# Altium schematic sheet Microcontroller.SchDoc: Payload Card Microcontroller
size A2; Revision: 1A; SheetNumber: 4; SheetTotal: 6; Organization: Brickworks; Address1: Matthew Glazer; Address2: Design Engineer
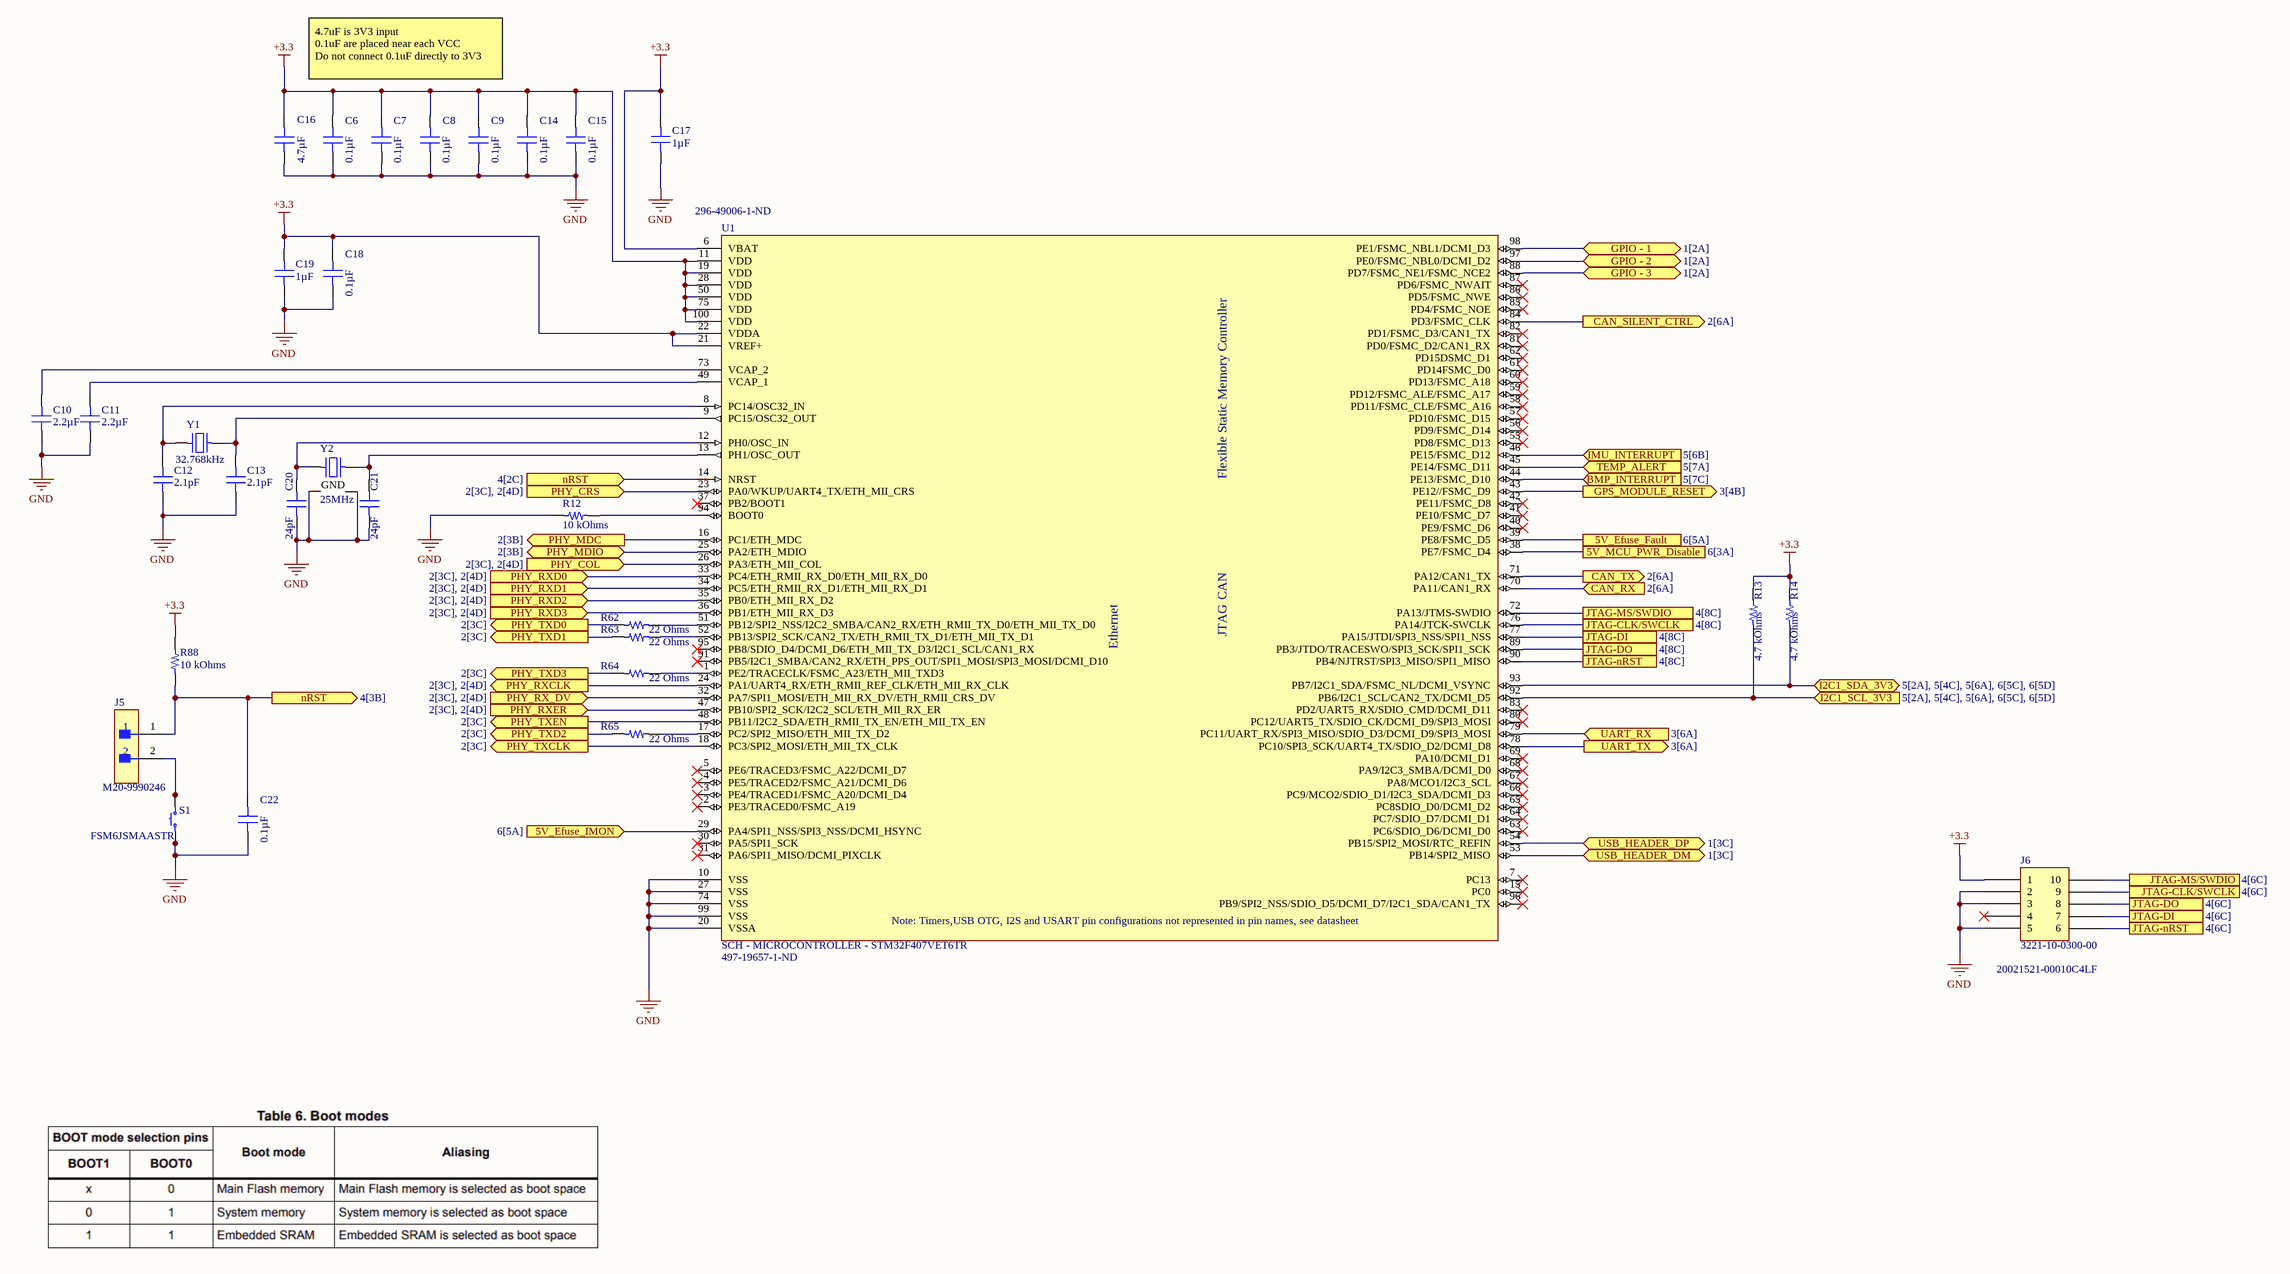
[diagram p0: Microcontroller.SchDoc]

## Parts
C6  0.1µF  [CAP 0603_1608]
C7  0.1µF  [CAP 0603_1608]
C8  0.1µF  [CAP 0603_1608]
C9  0.1µF  [CAP 0603_1608]
C10  2.2µF  [CAP 0603_1608]
C11  2.2µF  [CAP 0603_1608]
C12  2.1pF  [CAP 0603_1608]
C13  2.1pF  [CAP 0603_1608]
C14  0.1µF  [CAP 0603_1608]
C15  0.1µF  [CAP 0603_1608]
C16  4.7µF  [CAP 0603_1608]
C17  1µF  [CAP 0603_1608]
C18  0.1µF  [CAP 0603_1608]
C19  1µF  [CAP 0603_1608]
C20  24pF  [CAP 0603_1608]
C21  24pF  [CAP 0603_1608]
C22  0.1µF  [CAP 0603_1608]
J5  M20-9990246  [FP-M20-9990246-MFG]
J6  3221-10-0300-00  [CNC TECH 3221-10-0300-00]
R12  10 kOhms  [RES 0603_1608]
R13  4.7 kOhms  [RES 0603_1608]
R14  4.7 kOhms  [RES 0603_1608]
R62  22 Ohms  [RES 0603_1608]
R63  22 Ohms  [RES 0603_1608]
R64  22 Ohms  [RES 0603_1608]
R65  22 Ohms  [RES 0603_1608]
R88  10 kOhms  [RES 0603_1608]
S1  FSM6JSMAASTR  [TE FSM6JSMA]
U1  SCH - MICROCONTROLLER - STM32F407VET6TR  Supplier Part Number 1: 497-19657-1-ND  [PCB - LEADLESS - QFP - ST LQFP-100 14X14MM]
Y1  32.768kHz  [ABRACON ABS07]
Y2  25MHz  [EPSON TSX-3225]

## Ports
5V_Efuse_Fault (see 6[5A]), 5V_Efuse_IMON (in, see 6[5A]), 5V_MCU_PWR_Disable (see 6[3A]), BMP_INTERRUPT (in, see 5[7C]), CAN_RX (in, see 2[6A]), CAN_SILENT_CTRL (out, see 2[6A]), CAN_TX (out, see 2[6A]), GPIO - 1 (bidir, see 1[2A]), GPIO - 2 (bidir, see 1[2A]), GPIO - 3 (bidir, see 1[2A]), GPS_MODULE_RESET (out, see 3[4B]), I2C1_SCL_3V3 (in, see 5[2A], 5[4C], 5[6A], 6[5C], 6[5D]), I2C1_SDA_3V3 (bidir, see 5[2A], 5[4C], 5[6A], 6[5C], 6[5D]), IMU_INTERRUPT (in, see 5[6B]), JTAG-CLK/SWCLK (see 4[6C]), JTAG-CLK/SWCLK (see 4[8C]), JTAG-DI (see 4[6C]), JTAG-DI (see 4[8C]), JTAG-DO (see 4[6C]), JTAG-DO (see 4[8C]), JTAG-MS/SWDIO (see 4[6C]), JTAG-MS/SWDIO (see 4[8C]), JTAG-nRST (see 4[6C]), JTAG-nRST (see 4[8C]), nRST (in, see 4[2C]), nRST (out, see 4[3B]), PHY_COL (in, see 2[3C], 2[4D]), PHY_CRS (in, see 2[3C], 2[4D]), PHY_MDC (out, see 2[3B]), PHY_MDIO (bidir, see 2[3B]), PHY_RX_DV (in, see 2[3C], 2[4D]), PHY_RXCLK (out, see 2[3C], 2[4D]), PHY_RXD0 (in, see 2[3C], 2[4D]), PHY_RXD1 (in, see 2[3C], 2[4D]), PHY_RXD2 (in, see 2[3C], 2[4D]), PHY_RXD3 (in, see 2[3C], 2[4D]), PHY_RXER (in, see 2[3C], 2[4D]), PHY_TXCLK (out, see 2[3C]), PHY_TXD0 (out, see 2[3C]), PHY_TXD1 (out, see 2[3C]), PHY_TXD2 (out, see 2[3C]), PHY_TXD3 (out, see 2[3C]), PHY_TXEN (out, see 2[3C]), TEMP_ALERT (in, see 5[7A]), UART_RX (in, see 3[6A]), UART_TX (out, see 3[6A]), USB_HEADER_DM (bidir, see 1[3C]), USB_HEADER_DP (bidir, see 1[3C])

## Nets
+3.3: C6.2 C7.2 C8.2 C9.2 C14.2 C15.2 C16.2 C17.2 C18.2 C19.2 J6.1 R13.2 R14.2 R88.1 U1.6(VBAT) U1.11(VDD) U1.19(VDD) U1.21(VREF+) U1.22(VDDA) U1.28(VDD) U1.50(VDD) U1.75(VDD) U1.100(VDD)
GND: C6.1 C7.1 C8.1 C9.1 C10.1 C11.1 C12.1 C13.1 C14.1 C15.1 C16.1 C17.1 C18.1 C19.1 C20.1 C21.1 C22.1 J6.2 J6.3 J6.5 R12.2 S1.1 S1.2 U1.10(VSS) U1.20(VSSA) U1.27(VSS) U1.74(VSS) U1.99(VSS) Y2.2(GND) Y2.4(GND)
5V_Efuse_Fault: U1.39(PE8/FSMC_D5) ; port 5V_Efuse_Fault
5V_Efuse_IMON: U1.29(PA4/SPI1_NSS/SPI3_NSS/DCMI_HSYNC) ; port 5V_Efuse_IMON
5V_MCU_PWR_Disable: U1.38(PE7/FSMC_D4) ; port 5V_MCU_PWR_Disable
BMP_INTERRUPT: U1.44(PE13/FSMC_D10) ; port BMP_INTERRUPT
CAN_RX: U1.70(PA11/CAN1_RX) ; port CAN_RX
CAN_SILENT_CTRL: U1.84(PD3/FSMC_CLK) ; port CAN_SILENT_CTRL
CAN_TX: U1.71(PA12/CAN1_TX) ; port CAN_TX
GPIO - 1: U1.98(PE1/FSMC_NBL1/DCMI_D3) ; port GPIO - 1
GPIO - 2: U1.97(PE0/FSMC_NBL0/DCMI_D2) ; port GPIO - 2
GPIO - 3: U1.88(PD7/FSMC_NE1/FSMC_NCE2) ; port GPIO - 3
GPS_MODULE_RESET: U1.43(PE12//FSMC_D9) ; port GPS_MODULE_RESET
I2C1_SCL_3V3: R13.1 U1.92(PB6/I2C1_SCL/CAN2_TX/DCMI_D5) ; port I2C1_SCL_3V3
I2C1_SDA_3V3: R14.1 U1.93(PB7/I2C1_SDA/FSMC_NL/DCMI_VSYNC) ; port I2C1_SDA_3V3
IMU_INTERRUPT: U1.46(PE15/FSMC_D12) ; port IMU_INTERRUPT
JTAG-CLK/SWCLK: J6.9 U1.76(PA14/JTCK-SWCLK) ; port JTAG-CLK/SWCLK
JTAG-DI: J6.7 U1.77(PA15/JTDI/SPI3_NSS/SPI1_NSS) ; port JTAG-DI
JTAG-DO: J6.8 U1.89(PB3/JTDO/TRACESWO/SPI3_SCK/SPI1_SCK) ; port JTAG-DO
JTAG-MS/SWDIO: J6.10 U1.72(PA13/JTMS-SWDIO) ; port JTAG-MS/SWDIO
JTAG-nRST: J6.6 U1.90(PB4/NJTRST/SPI3_MISO/SPI1_MISO) ; port JTAG-nRST
nRST: C22.2 J5.1 R88.2 U1.14(NRST) ; port nRST
PHY_COL: U1.26(PA3/ETH_MII_COL) ; port PHY_COL
PHY_CRS: U1.23(PA0/WKUP/UART4_TX/ETH_MII_CRS) ; port PHY_CRS
PHY_MDC: U1.16(PC1/ETH_MDC) ; port PHY_MDC
PHY_MDIO: U1.25(PA2/ETH_MDIO) ; port PHY_MDIO
PHY_RX_DV: U1.32(PA7/SPI1_MOSI/ETH_MII_RX_DV/ETH_RMII_CRS_DV) ; port PHY_RX_DV
PHY_RXCLK: U1.24(PA1/UART4_RX/ETH_RMII_REF_CLK/ETH_MII_RX_CLK) ; port PHY_RXCLK
PHY_RXD0: U1.33(PC4/ETH_RMII_RX_D0/ETH_MII_RX_D0) ; port PHY_RXD0
PHY_RXD1: U1.34(PC5/ETH_RMII_RX_D1/ETH_MII_RX_D1) ; port PHY_RXD1
PHY_RXD2: U1.35(PB0/ETH_MII_RX_D2) ; port PHY_RXD2
PHY_RXD3: U1.36(PB1/ETH_MII_RX_D3) ; port PHY_RXD3
PHY_RXER: U1.47(PB10/SPI2_SCK/I2C2_SCL/ETH_MII_RX_ER) ; port PHY_RXER
PHY_TXCLK: U1.18(PC3/SPI2_MOSI/ETH_MII_TX_CLK) ; port PHY_TXCLK
PHY_TXD0: R62.1 ; port PHY_TXD0
PHY_TXD1: R63.1 ; port PHY_TXD1
PHY_TXD2: R65.1 ; port PHY_TXD2
PHY_TXD3: R64.1 ; port PHY_TXD3
PHY_TXEN: U1.48(PB11/I2C2_SDA/ETH_RMII_TX_EN/ETH_MII_TX_EN) ; port PHY_TXEN
TEMP_ALERT: U1.45(PE14/FSMC_D11) ; port TEMP_ALERT
UART_RX: U1.79(PC11/UART_RX/SPI3_MISO/SDIO_D3/DCMI_D9/SPI3_MOSI) ; port UART_RX
UART_TX: U1.78(PC10/SPI3_SCK/UART4_TX/SDIO_D2/DCMI_D8) ; port UART_TX
USB_HEADER_DM: U1.53(PB14/SPI2_MISO) ; port USB_HEADER_DM
USB_HEADER_DP: U1.54(PB15/SPI2_MOSI/RTC_REFIN) ; port USB_HEADER_DP
NetC10_2: C10.2 U1.73(VCAP_2)
NetC11_2: C11.2 U1.49(VCAP_1)
NetC12_2: C12.2 U1.8(PC14/OSC32_IN) Y1.1
NetC13_2: C13.2 U1.9(PC15/OSC32_OUT) Y1.2
NetC20_2: C20.2 U1.12(PH0/OSC_IN) Y2.1
NetC21_2: C21.2 U1.13(PH1/OSC_OUT) Y2.3
NetJ5_2: J5.2 S1.3 S1.4
NetR12_1: R12.1 U1.94(BOOT0)
NetR62_2: R62.2 U1.51(PB12/SPI2_NSS/I2C2_SMBA/CAN2_RX/ETH_RMII_TX_D0/ETH_MII_TX_D0)
NetR63_2: R63.2 U1.52(PB13/SPI2_SCK/CAN2_TX/ETH_RMII_TX_D1/ETH_MII_TX_D1)
NetR64_2: R64.2 U1.1(PE2/TRACECLK/FSMC_A23/ETH_MII_TXD3)
NetR65_2: R65.2 U1.17(PC2/SPI2_MISO/ETH_MII_TX_D2)

Not connected (* = marked no-connect by the designer): J6 4*; U1 2(PE3/TRACED0/FSMC_A19)* 3(PE4/TRACED1/FSMC_A20/DCMI_D4)* 4(PE5/TRACED2/FSMC_A21/DCMI_D6)* 5(PE6/TRACED3/FSMC_A22/DCMI_D7)* 7(PC13)* 15(PC0)* 30(PA5/SPI1_SCK)* 31(PA6/SPI1_MISO/DCMI_PIXCLK)* 37(PB2/BOOT1)* 40(PE9/FSMC_D6)* 41(PE10/FSMC_D7)* 42(PE11/FSMC_D8)* 55(PD8/FSMC_D13)* 56(PD9/FSMC_D14)* 57(PD10/FSMC_D15)* 58(PD11/FSMC_CLE/FSMC_A16)* 59(PD12/FSMC_ALE/FSMC_A17)* 60(PD13/FSMC_A18)* 61(PD14FSMC_D0)* 62(PD15DSMC_D1)* 63(PC6/SDIO_D6/DCMI_D0)* 64(PC7/SDIO_D7/DCMI_D1)* 65(PC8SDIO_D0/DCMI_D2)* 66(PC9/MCO2/SDIO_D1/I2C3_SDA/DCMI_D3)* 67(PA8/MCO1/I2C3_SCL)* 68(PA9/I2C3_SMBA/DCMI_D0)* 69(PA10/DCMI_D1)* 80(PC12/UART5_TX/SDIO_CK/DCMI_D9/SPI3_MOSI)* 81(PD0/FSMC_D2/CAN1_RX)* 82(PD1/FSMC_D3/CAN1_TX)* 83(PD2/UART5_RX/SDIO_CMD/DCMI_D11)* 85(PD4/FSMC_NOE)* 86(PD5/FSMC_NWE)* 87(PD6/FSMC_NWAIT)* 91(PB5/I2C1_SMBA/CAN2_RX/ETH_PPS_OUT/SPI1_MOSI/SPI3_MOSI/DCMI_D10)* 95(PB8/SDIO_D4/DCMI_D6/ETH_MII_TX_D3/I2C1_SCL/CAN1_RX)* 96(PB9/SPI2_NSS/SDIO_D5/DCMI_D7/I2C1_SDA/CAN1_TX)*

## Notes on the sheet
- 4.7uF is 3V3 input
  0.1uF are placed near each VCC
  Do not connect 0.1uF directly to 3V3
- (near J6) 20021521-00010C4LF
- Title
- Size:
- Date:
- File:
- A2
- Number:
- Time:
- Revision:
- Sheet
- of
- (in symbol SCH - MICROCONTROLLER - STM32F407VET6TR) Flexible Static Memory Controller; CAN; JTAG; Ethernet; Note: Timers,USB OTG, I2S and USART pin configurations not represented in pin names, see datasheet

## Library data of the parts
C6-C9 C14 C15 C18 C22 = CL10B104KA8WPNC: CAP CER 0.1UF 25V X7R 0603; Manufacturer: Samsung Electro-Mechanics; Tolerance: ±10%; Part Number: CL10B104KA8WPNC; Value: 0.1µF; Applications: Automotive; Capacitance: 0.1µF; ComponentLink1Description: Datasheet; ComponentLink1URL: http://www.samsungsem.com/kr/support/product-search/mlcc/CL10B104KA8WPNC.jsp; ComponentLink2Description: DigiKey Link; ComponentLink2URL: http://digikey.com/product-detail/en/samsung-electro-mechanics/CL10B104KA8WPNC/1276-6717-1-ND/5961576; Device Package: 0603 (1608 Metric); Features: Open Mode; LastUpdated: 9/2/2020 1:03:30 AM; Lifecycle Status: Active; Minimum Order: 1; Mounting Type: Surface Mount, MLCC; Operating Temperature: -55°C ~ 125°C; Package / Case: 0603 (1608 Metric); Packaging: TapeAndReel; PartId: 5631; Part Status: Active; Price: 0.02; Ratings: AEC-Q200; Series: CL; Size / Dimension: 0.063" L x 0.031" W (1.60mm x 0.80mm); Supplier 1: DigiKey; Supplier Part Number 1: 1276-6717-1-ND; Temperature Coefficient: X7R; Thickness (Max): 0.035" (0.90mm); Voltage - Rated: 25V
C10 C11 = EMK107BJ225KA-T: CAP CER 2.2UF 16V X5R 0603; Manufacturer: Taiyo Yuden; Tolerance: ±10%; Part Number: EMK107BJ225KA-T; Value: 2.2µF; Applications: General Purpose; Capacitance: 2.2µF; ComponentLink1Description: Datasheet; ComponentLink1URL: https://ds.yuden.co.jp/TYCOMPAS/ut/detail?pn=EMK107BJ225KA-T  &u=M; ComponentLink2Description: DigiKey Link; ComponentLink2URL: http://digikey.com/product-detail/en/taiyo-yuden/EMK107BJ225KA-T/587-1430-1-ND/1004061; Device Package: 0603 (1608 Metric); LastUpdated: 9/2/2020 1:03:30 AM; Lifecycle Status: Active; Minimum Order: 1; Mounting Type: Surface Mount, MLCC; Operating Temperature: -55°C ~ 85°C; Package / Case: 0603 (1608 Metric); Packaging: TapeAndReel; PartId: 5619; Part Status: Active; Price: 0.02; Series: M; Size / Dimension: 0.063" L x 0.031" W (1.60mm x 0.80mm); Supplier 1: DigiKey; Supplier Part Number 1: 587-1430-1-ND; Temperature Coefficient: X5R; Thickness (Max): 0.035" (0.90mm); Voltage - Rated: 16V
C12 C13 = CBR06C219B5GAC: CAP CER RF 2.1PF 50V +/-0.1 PF C; Manufacturer: KEMET; Temperature Coefficient: C0G, NP0; Tolerance: ±0.1pF; Part Number: CBR06C219B5GAC; Value: 2.1pF; Applications: RF, Microwave, High Frequency; Capacitance: 2.1pF; ComponentLink1Description: Datasheet; ComponentLink1URL: https://api.kemet.com/component-edge/download/datasheet/CBR06C219B5GAC.pdf; ComponentLink2Description: DigiKey Link; ComponentLink2URL: http://digikey.com/product-detail/en/kemet/CBR06C219B5GAC/399-16153-1-ND/7649738; Device Package: 0603 (1608 Metric); Features: High Q, Low Loss, Ultra Low ESR; LastUpdated: 9/2/2020 1:03:15 AM; Lifecycle Status: Active; Minimum Order: 1; Mounting Type: Surface Mount, MLCC; Operating Temperature: -55°C ~ 125°C; Package / Case: 0603 (1608 Metric); Packaging: TapeAndReel; PartId: 13663; Part Status: Active; Price: 0.05; Series: CBR-SMD RF C0G; Size / Dimension: 0.063" L x 0.031" W (1.60mm x 0.80mm); Supplier 1: DigiKey; Supplier Part Number 1: 399-16153-1-ND; Thickness (Max): 0.034" (0.87mm); Voltage - Rated: 50V
C16 = C1608X5R1C475K080AC: CAP CER 4.7UF 16V X5R 0603; Manufacturer: TDK Corporation; Tolerance: ±10%; Part Number: C1608X5R1C475K080AC; Value: 4.7µF; Applications: General Purpose; Capacitance: 4.7µF; ComponentLink1Description: Datasheet; ComponentLink1URL: https://product.tdk.com/info/en/catalog/datasheets/mlcc_commercial_general_en.pdf?ref_disty=digikey; ComponentLink2Description: DigiKey Link; ComponentLink2URL: http://digikey.com/product-detail/en/tdk-corporation/C1608X5R1C475K080AC/445-7478-1-ND/2733550; Device Package: 0603 (1608 Metric); Features: Low ESL; LastUpdated: 9/2/2020 1:03:17 AM; Lifecycle Status: Active; Minimum Order: 1; Mounting Type: Surface Mount, MLCC; Operating Temperature: -55°C ~ 85°C; Package / Case: 0603 (1608 Metric); Packaging: TapeAndReel; PartId: 12901; Part Status: Active; Price: 0.06; Series: C; Size / Dimension: 0.063" L x 0.031" W (1.60mm x 0.80mm); Supplier 1: DigiKey; Supplier Part Number 1: 445-7478-1-ND; Temperature Coefficient: X5R; Thickness (Max): 0.035" (0.90mm); Voltage - Rated: 16V
C17 C19 = GCM188R71C105KA64J: CAP CER 1UF 16V X7R 0603; Manufacturer: Murata Electronics; Tolerance: ±10%; Part Number: GCM188R71C105KA64J; Value: 1µF; Applications: Automotive; Capacitance: 1µF; ComponentLink1Description: Datasheet; ComponentLink1URL: https://www.murata.com/~/media/webrenewal/support/library/catalog/products/capacitor/mlcc/c03e.ashx?la=en-us; ComponentLink2Description: DigiKey Link; ComponentLink2URL: http://digikey.com/product-detail/en/murata-electronics/GCM188R71C105KA64J/490-12657-1-ND/5797626; Device Package: 0603 (1608 Metric); LastUpdated: 9/2/2020 1:03:14 AM; Lifecycle Status: Active; Minimum Order: 1; Mounting Type: Surface Mount, MLCC; Operating Temperature: -55°C ~ 125°C; Package / Case: 0603 (1608 Metric); Packaging: TapeAndReel; PartId: 13992; Part Status: Active; Price: 0.03; Ratings: AEC-Q200; Series: GCM; Size / Dimension: 0.063" L x 0.031" W (1.60mm x 0.80mm); Supplier 1: DigiKey; Supplier Part Number 1: 490-12657-1-ND; Temperature Coefficient: X7R; Thickness (Max): 0.035" (0.90mm); Voltage - Rated: 16V
C20 C21 = CL10C240JB8NNNC: CAP CER 24PF 50V C0G/NP0 0603; Manufacturer: Samsung Electro-Mechanics; Temperature Coefficient: C0G, NP0; Tolerance: ±5%; Part Number: CL10C240JB8NNNC; Value: 24pF; Applications: General Purpose; Capacitance: 24pF; ComponentLink1Description: Datasheet; ComponentLink1URL: http://www.samsungsem.com/kr/support/product-search/mlcc/CL10C240JB8NNNC.jsp; ComponentLink2Description: DigiKey Link; ComponentLink2URL: http://digikey.com/product-detail/en/samsung-electro-mechanics/CL10C240JB8NNNC/1276-1761-1-ND/3889847; Device Package: 0603 (1608 Metric); LastUpdated: 9/2/2020 1:03:22 AM; Lifecycle Status: Active; Minimum Order: 1; Mounting Type: Surface Mount, MLCC; Operating Temperature: -55°C ~ 125°C; Package / Case: 0603 (1608 Metric); Packaging: TapeAndReel; PartId: 10003; Part Status: Active; Price: 0.01; Series: CL; Size / Dimension: 0.063" L x 0.031" W (1.60mm x 0.80mm); Supplier 1: DigiKey; Supplier Part Number 1: 1276-1761-1-ND; Thickness (Max): 0.035" (0.90mm); Voltage - Rated: 50V
J5 = CMP-15831-000009-1: CONN HEADER VERT 2POS 2.54MM; Manufacturer: Harwin; Conn Gender: Male; Conn Orientation: Vertical; Number Of Contacts: 2; Current Rating: 3A; ComponentLink2URL: https://cdn.harwin.com/pdfs/M20-999.pdf; ComponentLink2Description: Datasheet; Package: M20-9990246; Temperature: -40°C to +105°C; Octopart: https://octopart.com/m20-9990246-harwin-2590635; Mouser Description: 2.54mm (0.1") Pitch SIL Vertical PC Tail Pin Header, 6.1mm mating pin height, tin, 2 contacts; Temperature Range High: +105°C; Device Class L1: Connectors; RoHS: TRUE; Automotive: No; Height: 8.99mm; Number Of Rows: 1; Contact Material: Tin,Nickel; Category: Conn; Pitch: 2.54mm; Lead Free: Yes; Digikey Description: CONN HEADER VERT 2POS 2.54MM; Manufacturer Part Number: M20-9990246; Temperature Range Low: -40°C; Device Class L3: unset; Device Class L2: Headers and Wire Housings
J6 = 3221-10-0300-00: CONN HEADER SMD 10POS 1.27MM; Manufacturer: CNC Tech; Current Rating (Amps): 1A; Material Flammability Rating: UL94 V-0; Number of Positions: 10; Number of Positions Loaded: All; Pitch - Mating: 0.050" (1.27mm); Shrouding: Shrouded - 4 Wall; Style: Board to Cable/Wire; Part Number: 3221-10-0300-00; ComponentLink1Description: Datasheet; ComponentLink1URL: http://cnctech.us/idcmatching2.pdf; ComponentLink2Description: DigiKey Link; ComponentLink2URL: http://digikey.com/product-detail/en/cnc-tech/3221-10-0300-00/1175-1735-ND/4878946; Connector Type: Header; Contact Finish - Mating: Gold; Contact Finish - Post: Gold; Contact Finish Thickness - Mating: Flash; Contact Material: Brass; Contact Shape: Square; Contact Type: Male Pin; Fastening Type: Push-Pull; Features: Keying Slot; Insulation Height: 0.213" (5.40mm); Insulation Material: Polyamide (PA6T), Nylon 6T; LastUpdated: 1/13/2020 12:09:21 AM; Lifecycle Status: Active; Minimum Order: 1; Mounting Type: Surface Mount; Number of Rows: 2; Operating Temperature: -40°C ~ 105°C; Packaging: Tray; PartId: 109; Part Status: Active; Price: 0.73; Row Spacing - Mating: 0.050" (1.27mm); Series: -; Supplier 1: DigiKey; Supplier Part Number 1: 1175-1735-ND; Termination: Solder
R12 R88 = RMCF0603JT10K0: RES 10K OHM 5% 1/10W 0603; Manufacturer: Stackpole Electronics Inc; Power (Watts): 0.1W, 1/10W; Temperature Coefficient: ±200ppm/°C; Part Number: RMCF0603JT10K0; Value: 10 kOhms; ComponentLink1Description: Datasheet; ComponentLink1URL: https://www.seielect.com/catalog/sei-packaging.pdf; ComponentLink2Description: DigiKey Link; ComponentLink2URL: http://digikey.com/product-detail/en/stackpole-electronics-inc/RMCF0603JT10K0/RMCF0603JT10K0CT-ND/1943191; Composition: Thick Film; Device Package: 0603 (1608 Metric); Features: Automotive AEC-Q200; Height - Seated (Max): 0.022" (0.55mm); LastUpdated: 8/30/2020 8:48:45 PM; Lifecycle Status: Active; Minimum Order: 1; Number of Terminations: 2; Operating Temperature: -55°C ~ 155°C; Package / Case: 0603 (1608 Metric); Packaging: CutTape; PartId: 25659; Part Status: Active; Price: 0.10; Ratings: AEC-Q200; Resistance: 10 kOhms; Series: RMCF; Size / Dimension: 0.061" L x 0.031" W (1.55mm x 0.80mm); Supplier 1: DigiKey; Supplier Part Number 1: RMCF0603JT10K0CT-ND; Supplier Device Package: 0603; Tolerance: ±5%
R13 R14 = RMCF0603FT4K70: RES 4.7K OHM 1% 1/10W 0603; Manufacturer: Stackpole Electronics Inc; Power (Watts): 0.1W, 1/10W; Temperature Coefficient: ±100ppm/°C; Part Number: RMCF0603FT4K70; Value: 4.7 kOhms; ComponentLink1Description: Datasheet; ComponentLink1URL: https://www.seielect.com/catalog/sei-rmcf_rmcp.pdf; ComponentLink2Description: DigiKey Link; ComponentLink2URL: http://digikey.com/product-detail/en/stackpole-electronics-inc/RMCF0603FT4K70/RMCF0603FT4K70CT-ND/1943033; Composition: Thick Film; Device Package: 0603 (1608 Metric); Features: Automotive AEC-Q200; Height - Seated (Max): 0.022" (0.55mm); LastUpdated: 9/2/2020 1:10:22 AM; Lifecycle Status: Active; Minimum Order: 1; Number of Terminations: 2; Operating Temperature: -55°C ~ 155°C; Package / Case: 0603 (1608 Metric); Packaging: CutTape; PartId: 6078; Part Status: Active; Price: 0.10; Ratings: AEC-Q200; Resistance: 4.7 kOhms; Series: RMCF; Size / Dimension: 0.061" L x 0.031" W (1.55mm x 0.80mm); Supplier 1: DigiKey; Supplier Part Number 1: RMCF0603FT4K70CT-ND; Supplier Device Package: 0603; Tolerance: ±1%
R62-R65 = RMCF0603FT22R0: RES 22 OHM 1% 1/10W 0603; Manufacturer: Stackpole Electronics Inc; Power (Watts): 0.1W, 1/10W; Temperature Coefficient: ±100ppm/°C; Part Number: RMCF0603FT22R0; Value: 22 Ohms; ComponentLink1Description: Datasheet; ComponentLink1URL: https://www.seielect.com/catalog/sei-packaging.pdf; ComponentLink2Description: DigiKey Link; ComponentLink2URL: http://digikey.com/product-detail/en/stackpole-electronics-inc/RMCF0603FT22R0/RMCF0603FT22R0CT-ND/1942946; Composition: Thick Film; Device Package: 0603 (1608 Metric); Features: Automotive AEC-Q200; Height - Seated (Max): 0.022" (0.55mm); LastUpdated: 9/2/2020 1:10:13 AM; Lifecycle Status: Active; Minimum Order: 1; Number of Terminations: 2; Operating Temperature: -55°C ~ 155°C; Package / Case: 0603 (1608 Metric); Packaging: CutTape; PartId: 10611; Part Status: Active; Price: 0.10; Ratings: AEC-Q200; Resistance: 22 Ohms; Series: RMCF; Size / Dimension: 0.061" L x 0.031" W (1.55mm x 0.80mm); Supplier 1: DigiKey; Supplier Part Number 1: RMCF0603FT22R0CT-ND; Supplier Device Package: 0603; Tolerance: ±1%
S1 = FSM6JSMAASTR: SWITCH TACTILE SPST-NO 0.05A 24V; Manufacturer: TE Connectivity ALCOSWITCH Switches; Actuator Height off PCB, Vertical: 7.00mm; Actuator Orientation: Top Actuated; Actuator Type: Standard; Contact Rating @ Voltage: 0.05A @ 24VDC; Illumination: Non-Illuminated; Operating Force: 260gf; Outline: 6.00mm x 6.00mm; Switch Function: Off-Mom; Part Number: FSM6JSMAASTR; Circuit: SPST-NO; ComponentLink1Description: Datasheet; ComponentLink1URL: https://www.te.com/commerce/DocumentDelivery/DDEController?Action=srchrtrv&DocNm=1308111-1_SWITCHES_CORE_PROGRAM_CATALOG&DocType=CS&DocLang=English; ComponentLink2Description: DigiKey Link; ComponentLink2URL: http://digikey.com/product-detail/en/te-connectivity-alcoswitch-switches/FSM6JSMAASTR/450-2138-1-ND/5343818; LastUpdated: 9/2/2020 1:27:08 AM; Lifecycle Status: Active; Minimum Order: 1; Mounting Type: Surface Mount; Operating Temperature: -40°C ~ 105°C; Packaging: TapeAndReel; Part Status: Active; Price: 0.37; Series: FSMJSMA; Supplier 1: DigiKey; Supplier Part Number 1: 450-2138-1-ND; Termination Style: Gull Wing
Y1 = ABS07-166-32.768KHZ-T: IOT 32.786KHZ XTAL; Manufacturer: Abracon LLC; ESR (Equivalent Series Resistance): 70 kOhms; Frequency Tolerance: ±10ppm; Load Capacitance: 7pF; Operating Mode: Fundamental; Part Number: ABS07-166-32.768KHZ-T; ComponentLink1Description: Datasheet; ComponentLink1URL: https://abracon.com/datasheets/ABS07-166-32.768kHz-T.pdf; ComponentLink2Description: DigiKey Link; ComponentLink2URL: http://digikey.com/product-detail/en/abracon-llc/ABS07-166-32.768KHZ-T/535-14514-1-ND/8827205; Frequency: 32.768kHz; Height - Seated (Max): 0.035" (0.90mm); LastUpdated: 9/2/2020 1:21:47 AM; Lifecycle Status: Active; Minimum Order: 1; Mounting Type: Surface Mount; Operating Temperature: -40°C ~ 85°C; Package / Case: 2-SMD, No Lead; Packaging: TapeAndReel; PartId: 384; Part Status: Active; Price: 0.35; Series: ABS07; Size / Dimension: 0.126" L x 0.059" W (3.20mm x 1.50mm); Supplier 1: DigiKey; Supplier Part Number 1: 535-14514-1-ND; Type: kHz Crystal (Tuning Fork); Value: 32.768kHz
Y2 = TSX-3225 25.0000MF20P-C0: CRYSTAL 25.0000MHZ 18PF SMD; Manufacturer: EPSON; ESR (Equivalent Series Resistance): 40 Ohms; Frequency Stability: ±20ppm; Frequency Tolerance: ±10ppm; Operating Mode: Fundamental; Part Number: TSX-3225 25.0000MF20P-C0; ComponentLink1Description: Datasheet; ComponentLink1URL: https://support.epson.biz/td/api/doc_check.php?dl=brief_TSX-3225&lang=en; ComponentLink2Description: DigiKey Link; ComponentLink2URL: http://digikey.com/product-detail/en/epson/TSX-3225-25.0000MF20P-C0/SER4212CT-ND/7430967; Frequency: 25MHz; Height - Seated (Max): 0.024" (0.60mm); LastUpdated: 9/2/2020 1:21:54 AM; Lifecycle Status: Active; Load Capacitance: 18pF; Minimum Order: 1; Mounting Type: Surface Mount; Operating Temperature: -20°C ~ 85°C; Package / Case: 4-SMD, No Lead; Packaging: TapeAndReel; PartId: 447; Part Status: Active; Price: 0.18; Series: TSX-3225; Size / Dimension: 0.126" L x 0.098" W (3.20mm x 2.50mm); Supplier 1: DigiKey; Supplier Part Number 1: SER4212CT-ND; Type: MHz Crystal; Value: 25MHz
U1 = SCH - MICROCONTROLLER - STM32F407VET6TR: Supplier 1: Digi-Key